# EAGLE design wiring_thermography (EAGLE 9.4.2)
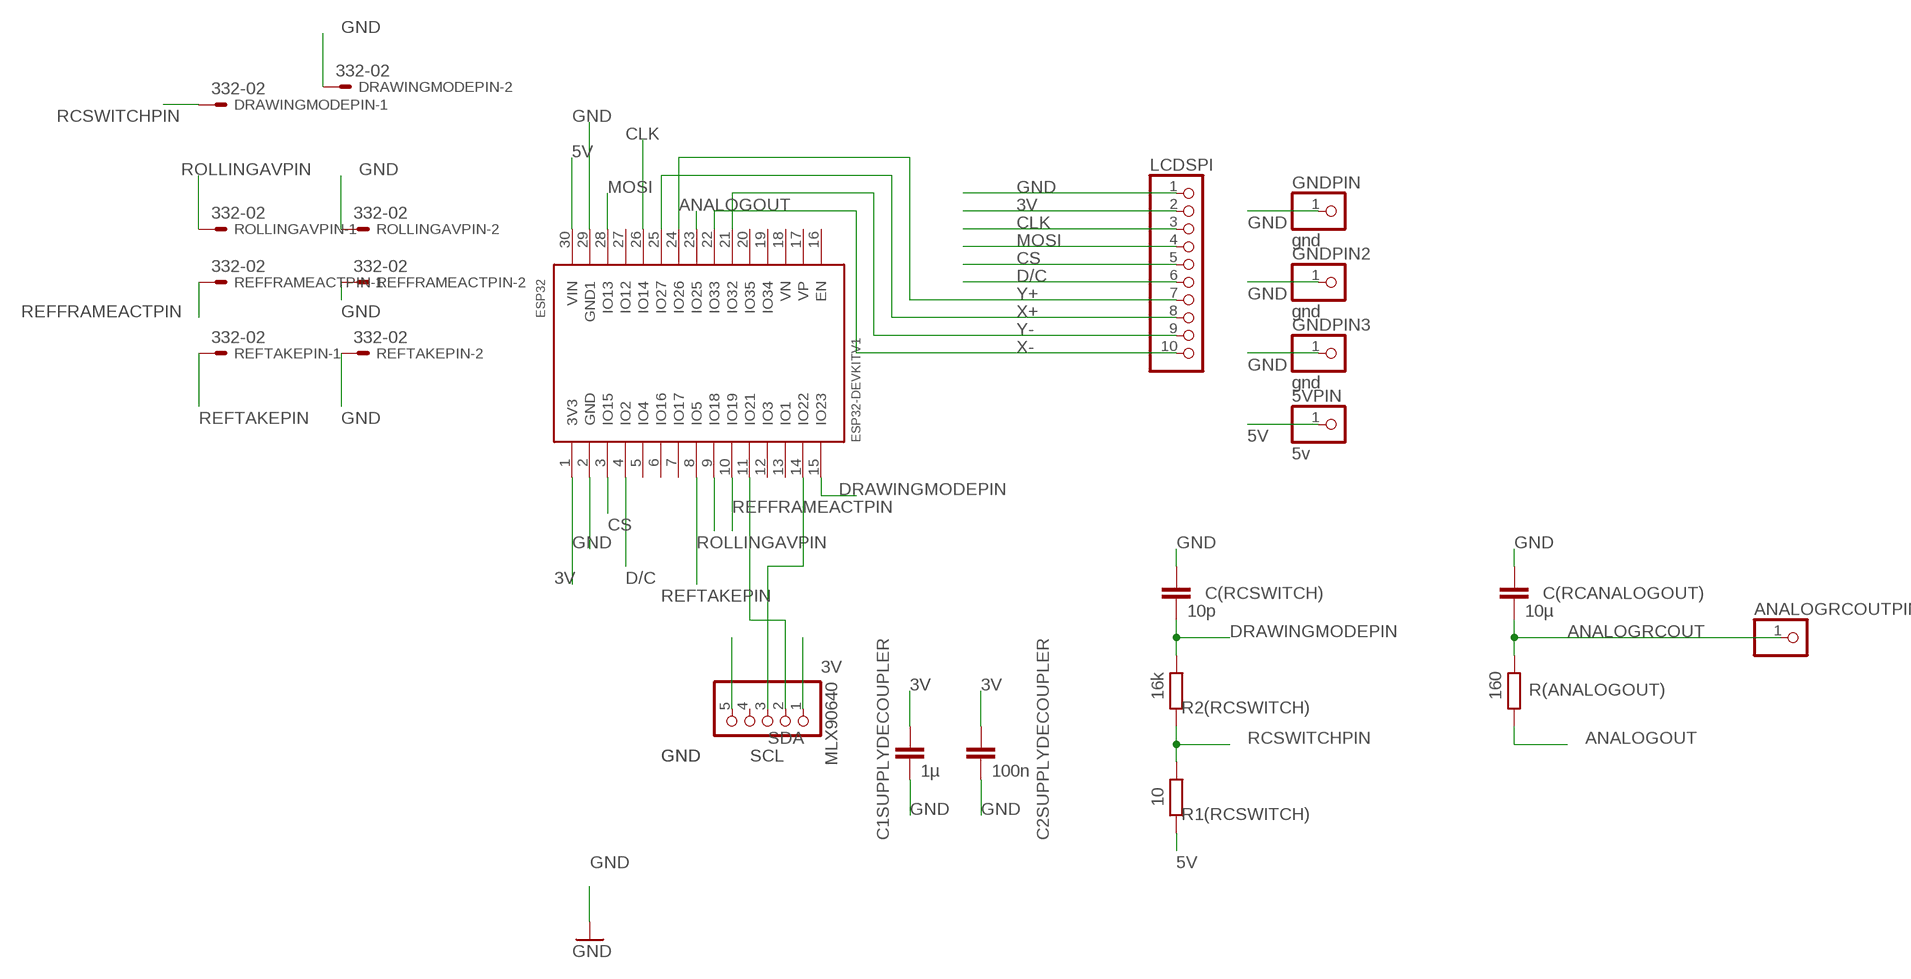
[diagram p0: schematic, sheet 1]

## Parts
5VPIN  5v  PINHD-1X1  [1X01]
ANALOGRCOUTPIN  PINHD-1X1  [1X01]
C1SUPPLYDECOUPLER  1µ  C5/5  [C5B5]
C2SUPPLYDECOUPLER  100n  C5/5  [C5B5]
C(RCANALOGOUT)  10µ  C5/5  [C5B5]
C(RCSWITCH)  10p  C5/5  [C5B5]
DRAWINGMODEPIN  332-02  [332-02]
ESP32  ESP32DEVKITV1  [ESP32-DEVKITV1]
GNDPIN  gnd  PINHD-1X1  [1X01]
GNDPIN2  gnd  PINHD-1X1  [1X01]
GNDPIN3  gnd  PINHD-1X1  [1X01]
LCDSPI  PINHD-1X10  [1X10]
MLX90640  PINHD-1X5  [1X05]
R1(RCSWITCH)  10  R-EU_0207/7  [0207/7]
R2(RCSWITCH)  16k  R-EU_0207/7  [0207/7]
R(ANALOGOUT)  160  R-EU_0207/7  [0207/7]
REFFRAMEACTPIN  332-02  [332-02]
REFTAKEPIN  332-02  [332-02]
ROLLINGAVPIN  332-02  [332-02]

## Nets
3V: C1SUPPLYDECOUPLER.1 C2SUPPLYDECOUPLER.1 ESP32.1(3V3) LCDSPI.2 MLX90640.1
5V: 5VPIN.1 ESP32.30(VIN) R1(RCSWITCH).1
ANALOGOUT: ESP32.23(IO25) R(ANALOGOUT).1
ANALOGRCOUT: ANALOGRCOUTPIN.1 C(RCANALOGOUT).2 R(ANALOGOUT).2
CLK: ESP32.26(IO14) LCDSPI.3
CS: ESP32.3(IO15) LCDSPI.5
D/C: ESP32.4(IO2) LCDSPI.6
DRAWINGMODEPIN: C(RCSWITCH).2 ESP32.15(IO23) R2(RCSWITCH).2
GND: C1SUPPLYDECOUPLER.2 C2SUPPLYDECOUPLER.2 C(RCANALOGOUT).1 C(RCSWITCH).1 DRAWINGMODEPIN.2 ESP32.2(GND) ESP32.29(GND1) GNDPIN2.1 GNDPIN3.1 GNDPIN.1 LCDSPI.1 MLX90640.5 REFFRAMEACTPIN.2 REFTAKEPIN.2 ROLLINGAVPIN.2
MOSI: ESP32.28(IO13) LCDSPI.4
RCSWITCHPIN: DRAWINGMODEPIN.1 R1(RCSWITCH).2 R2(RCSWITCH).1
REFFRAMEACTPIN: ESP32.10(IO19) REFFRAMEACTPIN.1
REFTAKEPIN: ESP32.8(IO5) REFTAKEPIN.1
ROLLINGAVPIN: ESP32.9(IO18) ROLLINGAVPIN.1
SCL: ESP32.14(IO22) MLX90640.3
SDA: ESP32.11(IO21) MLX90640.2
X+: ESP32.25(IO27) LCDSPI.8
X-: ESP32.22(IO33) LCDSPI.10
Y+: ESP32.24(IO26) LCDSPI.7
Y-: ESP32.21(IO32) LCDSPI.9
Unconnected: ESP32.5(IO4) ESP32.6(IO16) ESP32.7(IO17) ESP32.12(IO3) ESP32.13(IO1) ESP32.16(EN) ESP32.17(VP) ESP32.18(VN) ESP32.19(IO34) ESP32.20(IO35) ESP32.27(IO12) MLX90640.4

## Library data of the parts
5VPIN ANALOGRCOUTPIN GNDPIN GNDPIN2 GNDPIN3 = pinhead:PINHD-1X1: PIN HEADER
C1SUPPLYDECOUPLER C2SUPPLYDECOUPLER C(RCANALOGOUT) C(RCSWITCH) = capacitor-wima:C: CAPACITOR naming: grid - package width
DRAWINGMODEPIN REFFRAMEACTPIN REFTAKEPIN ROLLINGAVPIN = con-garry:332-02: 2 Pin - 2mm Dual Row Source: www.mpe-connector.de / garry_shortform_2012.pdf
ESP32 = ESP32-DEVKITV1:ESP32DEVKITV1
LCDSPI = pinhead:PINHD-1X10: PIN HEADER
MLX90640 = pinhead:PINHD-1X5: PIN HEADER
R1(RCSWITCH) R2(RCSWITCH) R(ANALOGOUT) = rcl:R-EU_: RESISTOR, European symbol; SPICEPREFIX: R

## Board
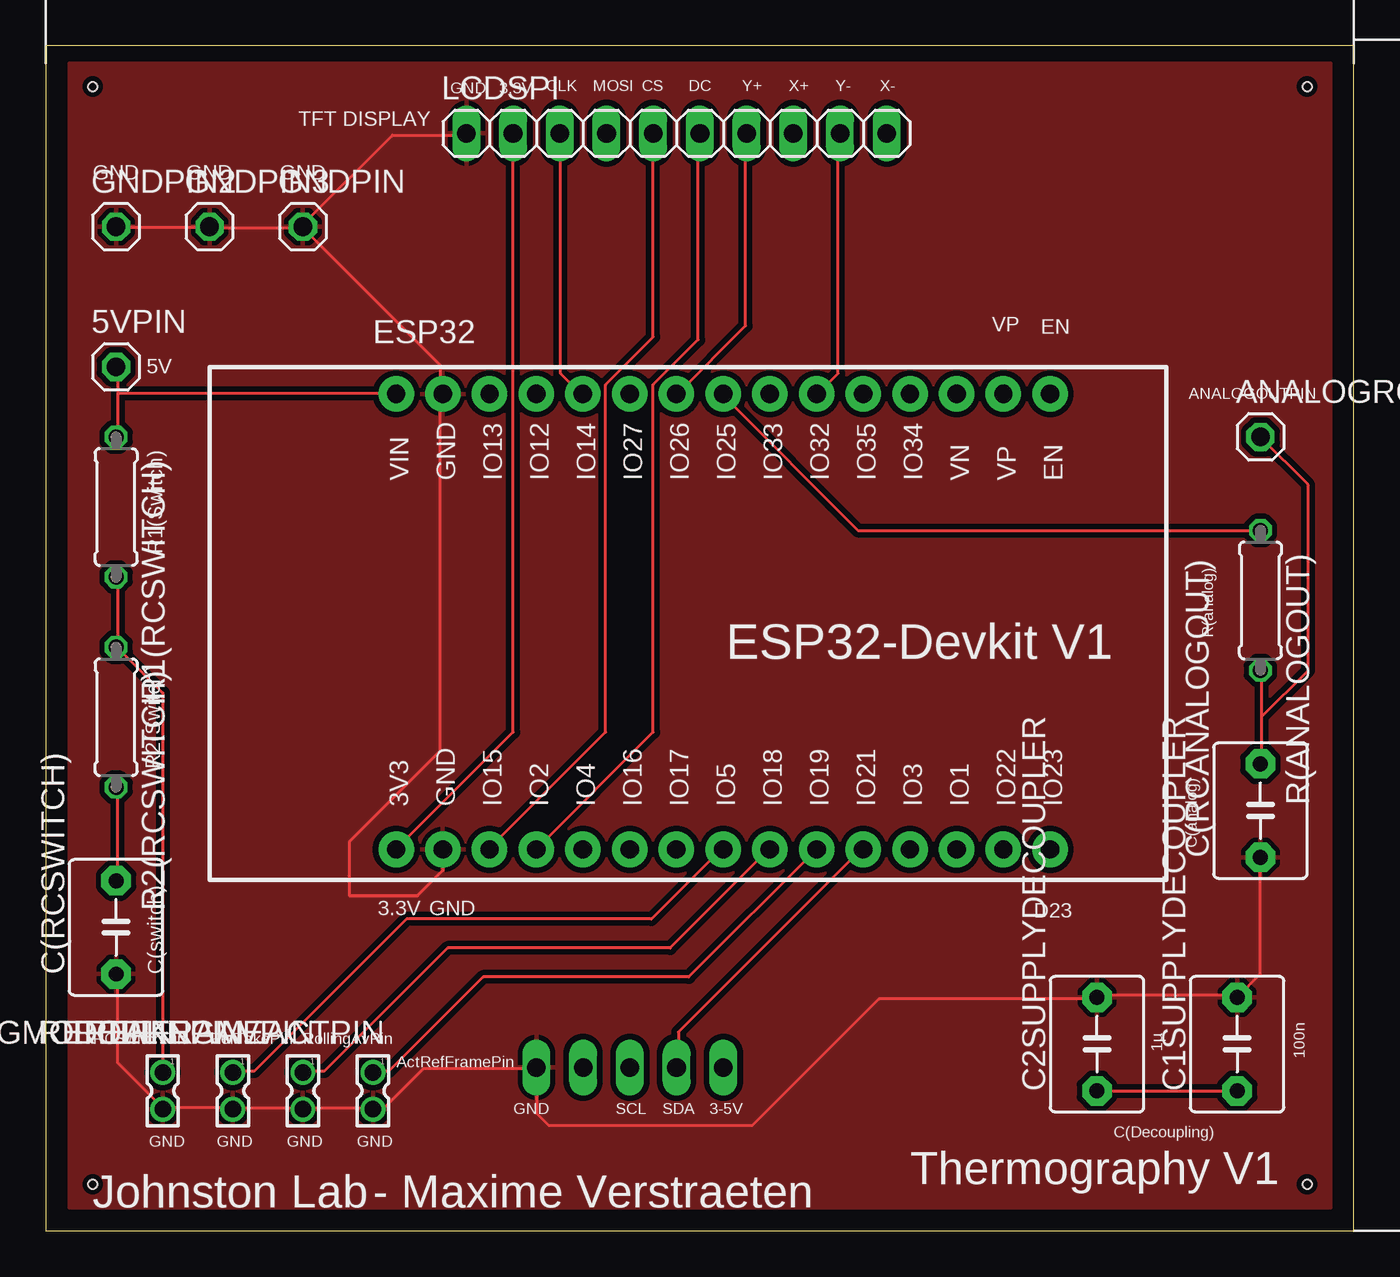
[diagram p1: board, top side]
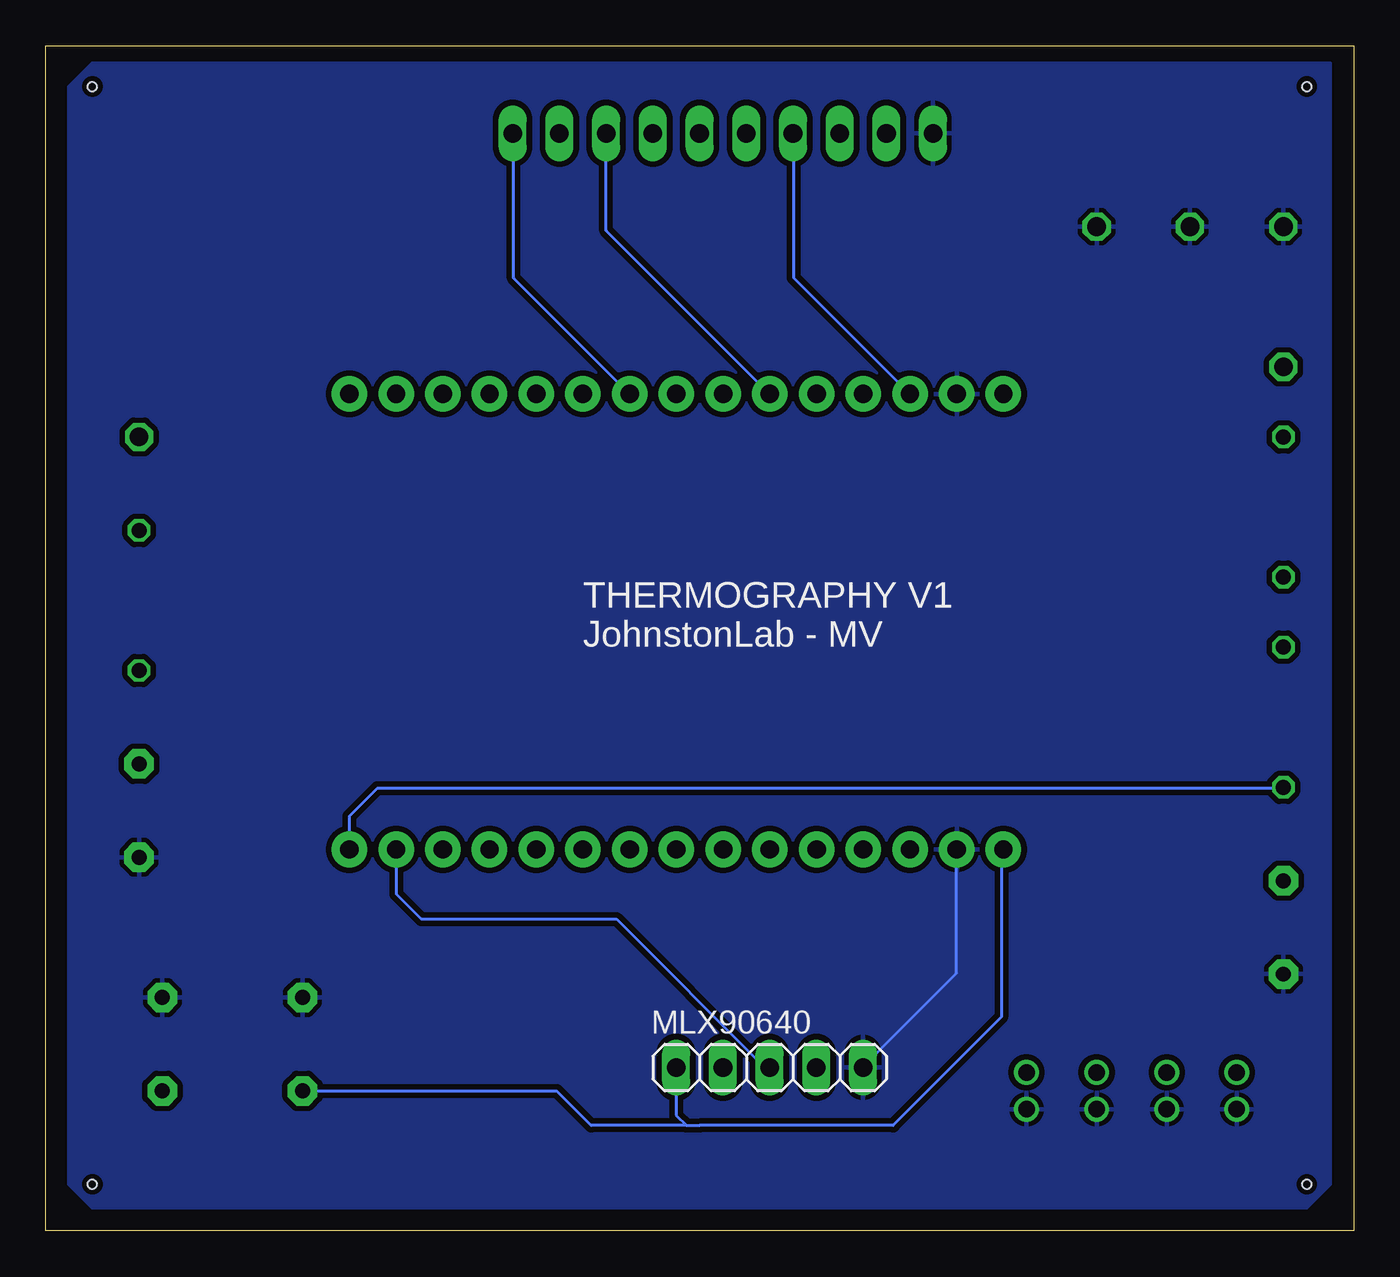
[diagram p2: board, bottom side, seen from below]

Size 71.1 x 64.44 mm. Coordinates in mm from the lower left corner, seen from the top.
Outline: 0,0 71.1,0 71.1,64.44 0,64.44 0,0
Copper layers (1*16): Top 0.035559375mm / dielectric 1.6mm / Bottom 0.035559375mm
Design rules "jlcpcb2layer": minimum track width 5mil, minimum drill 12mil, track to track 5mil, track to pad 5mil, pad to pad 5mil, via to via 5mil, smd to smd 5mil, copper to edge 8mil, drill to drill 6mil, minimum pad ring 5mil, minimum via ring 3mil, stop-mask expansion 2.5mil, vias tented up to drill 0mil, thermal gap 10mil
Holes 0.5 mm at 68.58,62.23 68.58,2.54 2.54,2.54 2.54,62.23

### Footprints (pad centres in the part's own frame; a part is rotated, then mirrored left to right if it is on the bottom)
1X01 = drill 1.016 octagon: 1 0,0
C5B5 = drill 0.813 pad 1.6 octagon: 1 -2.54,0; 2 2.54,0
332-02 = drill 0.9 pad 1.27: 1 0,-1; 2 0,1
ESP32-DEVKITV1 = drill 1 pad 1.93: 1 -22.87,-13.54; 2 -20.33,-13.54; 3 -17.79,-13.54; 4 -15.25,-13.54; 5 -12.71,-13.54; 6 -10.17,-13.54; 7 -7.63,-13.54; 8 -5.09,-13.54; 9 -2.55,-13.54; 10 -0.01,-13.54; 11 2.53,-13.54; 12 5.07,-13.54; 13 7.61,-13.54; 14 10.15,-13.54; 15 12.69,-13.54; 16 12.69,11.23; 17 10.15,11.23; 18 7.61,11.23; 19 5.07,11.23; 20 2.53,11.23; 21 -0.01,11.23; 22 -2.55,11.23; 23 -5.09,11.23; 24 -7.63,11.23; 25 -10.17,11.23; 26 -12.71,11.23; 27 -15.25,11.23; 28 -17.79,11.23; 29 -20.33,11.23; 30 -22.87,11.23
1X10 = drill 1.016 long: 1 -11.43,0; 2 -8.89,0; 3 -6.35,0; 4 -3.81,0; 5 -1.27,0; 6 1.27,0; 7 3.81,0; 8 6.35,0; 9 8.89,0; 10 11.43,0
1X05 = drill 1.016 long: 1 -5.08,0; 2 -2.54,0; 3 0,0; 4 2.54,0; 5 5.08,0
0207/7 = drill 0.813 octagon: 1 -3.81,0; 2 3.81,0

### Placement (x,y rotation side)
5VPIN  3.81,46.99 0 top
ANALOGRCOUTPIN  66.04,43.18 0 top
C1SUPPLYDECOUPLER  64.77,10.16 90 top
C2SUPPLYDECOUPLER  57.15,10.16 90 top
C(RCANALOGOUT)  66.04,22.86 90 top
C(RCSWITCH)  3.81,16.51 90 top
DRAWINGMODEPIN  6.35,7.62 180 top
ESP32  41.91,34.29 0 top
GNDPIN  13.97,54.61 0 top
GNDPIN2  3.81,54.61 0 top
GNDPIN3  8.89,54.61 0 top
LCDSPI  34.29,59.69 0 top
MLX90640  31.75,8.89 0 bottom
R1(RCSWITCH)  3.81,39.37 270 top
R2(RCSWITCH)  3.81,27.94 270 top
R(ANALOGOUT)  66.04,34.29 270 top
REFFRAMEACTPIN  17.78,7.62 180 top
REFTAKEPIN  10.16,7.62 180 top
ROLLINGAVPIN  13.97,7.62 180 top

### Tracks (layer width: path | path; a pad name or v marks a point on that pad's centre or on a via)
3V
  Top 0.152: C2SUPPLYDECOUPLER.1 C1SUPPLYDECOUPLER.1 | LCDSPI.2 25.4,27.13 19.15,20.88 ESP32.1
  Bottom 0.152: C2SUPPLYDECOUPLER.1 43.33,7.62 41.45,5.74 36.27,5.74 | MLX90640.1 36.83,6.3 36.27,5.74 | ESP32.1 19.15,20.73 19.15,11.63 25.04,5.74 35.56,5.74 36.27,5.74
5V
  Top 0.152: 3.91,45.57 3.91,46.94 5VPIN.1 | 3.91,45.57 3.91,43.28 R1(RCSWITCH).1 | 3.91,45.57 19,45.57 ESP32.30
ANALOGOUT
  Top 0.152: R(ANALOGOUT).1 44.15,38.1 36.83,45.42 ESP32.23
ANALOGRCOUT
  Top 0.152: C(RCANALOGOUT).2 66.09,25.45 66.09,27.94 | 66.09,27.94 66.09,30.48 R(ANALOGOUT).2 | 66.09,27.94 68.63,30.48 68.63,40.59 ANALOGRCOUTPIN.1
CLK
  Top 0.152: LCDSPI.3 27.99,59.59 27.99,46.63 29.06,45.57 ESP32.26
CS
  Top 0.152: LCDSPI.5 33.02,48.62 30.43,46.03 30.43,27.13 24.18,20.88 ESP32.3
D/C
  Top 0.152: LCDSPI.6 35.46,59.59 35.46,48.46 33.02,46.03 33.02,27.13 26.77,20.88 ESP32.4
DRAWINGMODEPIN
  Top 0.152: R2(RCSWITCH).2 3.91,24.08 3.91,19.05 C(RCSWITCH).2
  Bottom 0.152: ESP32.15 54.6,22.56 53.09,24.08 3.91,24.08 R2(RCSWITCH).2
GND
  Top 0.152: GNDPIN2.1 3.91,54.56 8.79,54.56 GNDPIN3.1 8.94,54.56 13.97,54.56 | LCDSPI.1 22.81,59.59 18.85,59.59 13.97,54.71 GNDPIN.1 13.97,54.56 | 13.97,54.56 21.44,47.09 21.44,45.57 ESP32.29 21.44,45.42 21.44,26.11 16.51,21.18 16.51,18.24 20.22,18.24 21.58,19.6 ESP32.2 | C(RCANALOGOUT).1 66.04,13.97 C1SUPPLYDECOUPLER.2 64.72,12.8 57.25,12.8 C2SUPPLYDECOUPLER.2 57.1,12.65 45.31,12.65 38.41,5.74 27.33,5.74 26.67,6.4 MLX90640.5 26.62,8.84 20.52,8.84 18.39,6.71 17.78,6.71 | 10.16,6.71 6.35,6.71 | 10.16,6.71 13.97,6.71 | 10.16,6.71 REFTAKEPIN.2 | 13.97,6.71 17.78,6.71 | 13.97,6.71 ROLLINGAVPIN.2 | 17.78,6.71 REFFRAMEACTPIN.2 | 6.35,6.71 3.91,9.14 3.91,13.87 C(RCSWITCH).1 | 6.35,6.71 DRAWINGMODEPIN.2
  Bottom 0.152: ESP32.2 21.59,20.73 21.59,14.02 26.62,8.99 MLX90640.5
  pour Top (isolate 0.305): 1.27,63.5 1.27,1.27 69.85,1.27 69.85,63.5
  pour Bottom (isolate 0.305): 1.27,63.5 1.27,2.54 2.54,1.27 68.58,1.27 69.85,2.54 69.85,62.23 68.58,63.5
MOSI
  Bottom 0.152: LCDSPI.4 30.43,59.59 30.43,51.82 24.18,45.57 ESP32.28
RCSWITCHPIN
  Top 0.152: R1(RCSWITCH).2 3.91,35.51 3.91,31.85 R2(RCSWITCH).1 3.91,31.7 6.35,29.26 DRAWINGMODEPIN.1
REFFRAMEACTPIN
  Top 0.152: REFFRAMEACTPIN.1 17.78,8.69 18.64,8.69 23.77,13.82 34.95,13.82 41.86,20.73 ESP32.10
REFTAKEPIN
  Top 0.152: REFTAKEPIN.1 10.16,8.69 11.33,8.69 19.61,16.97 32.92,16.97 36.68,20.73 ESP32.8
ROLLINGAVPIN
  Top 0.152: ROLLINGAVPIN.1 13.97,8.69 15.14,8.69 21.84,15.39 33.93,15.39 39.27,20.73 ESP32.9
SCL
  Bottom 0.152: ESP32.14 52.06,18.33 50.7,16.97 40.08,16.97 32.11,8.99 31.8,8.99 MLX90640.3
SDA
  Top 0.152: MLX90640.2 34.39,8.99 34.39,10.82 44.3,20.73 ESP32.11
X+
  Bottom 0.152: LCDSPI.8 40.64,54.41 31.8,45.57 ESP32.25
X-
  Bottom 0.152: LCDSPI.10 45.67,59.59 45.67,51.82 39.42,45.57 ESP32.22
Y+
  Top 0.152: LCDSPI.7 38.05,59.59 38.05,49.22 34.39,45.57 ESP32.24
Y-
  Top 0.152: LCDSPI.9 43.08,59.59 43.08,46.63 42.01,45.57 ESP32.21

### Text on the board
tPlace: GND | 3.3V | CLK | MOSI | CS | DC | Y+ | X+ | Y- | X- | TFT DISPLAY | GND | GND | GND | VP | EN | 5V | ANALOGOUTPIN | R1(Switch) | R(analog) | R2(Switch) | C(analog) | 3.3V | GND | D23 | C(switch) | RCSwitchPin | RefTakePin | RollingAvPin | 1µ | ActRefFramePin | 100n | GND | SCL | SDA | 3-5V | C(Decoupling) | GND | GND | GND | GND | Thermography V1 | Johnston Lab | - Maxime Verstraeten
bPlace: THERMOGRAPHY V1 / JohnstonLab - MV